# Altium schematic sheet Shematic.SchDoc
size A4
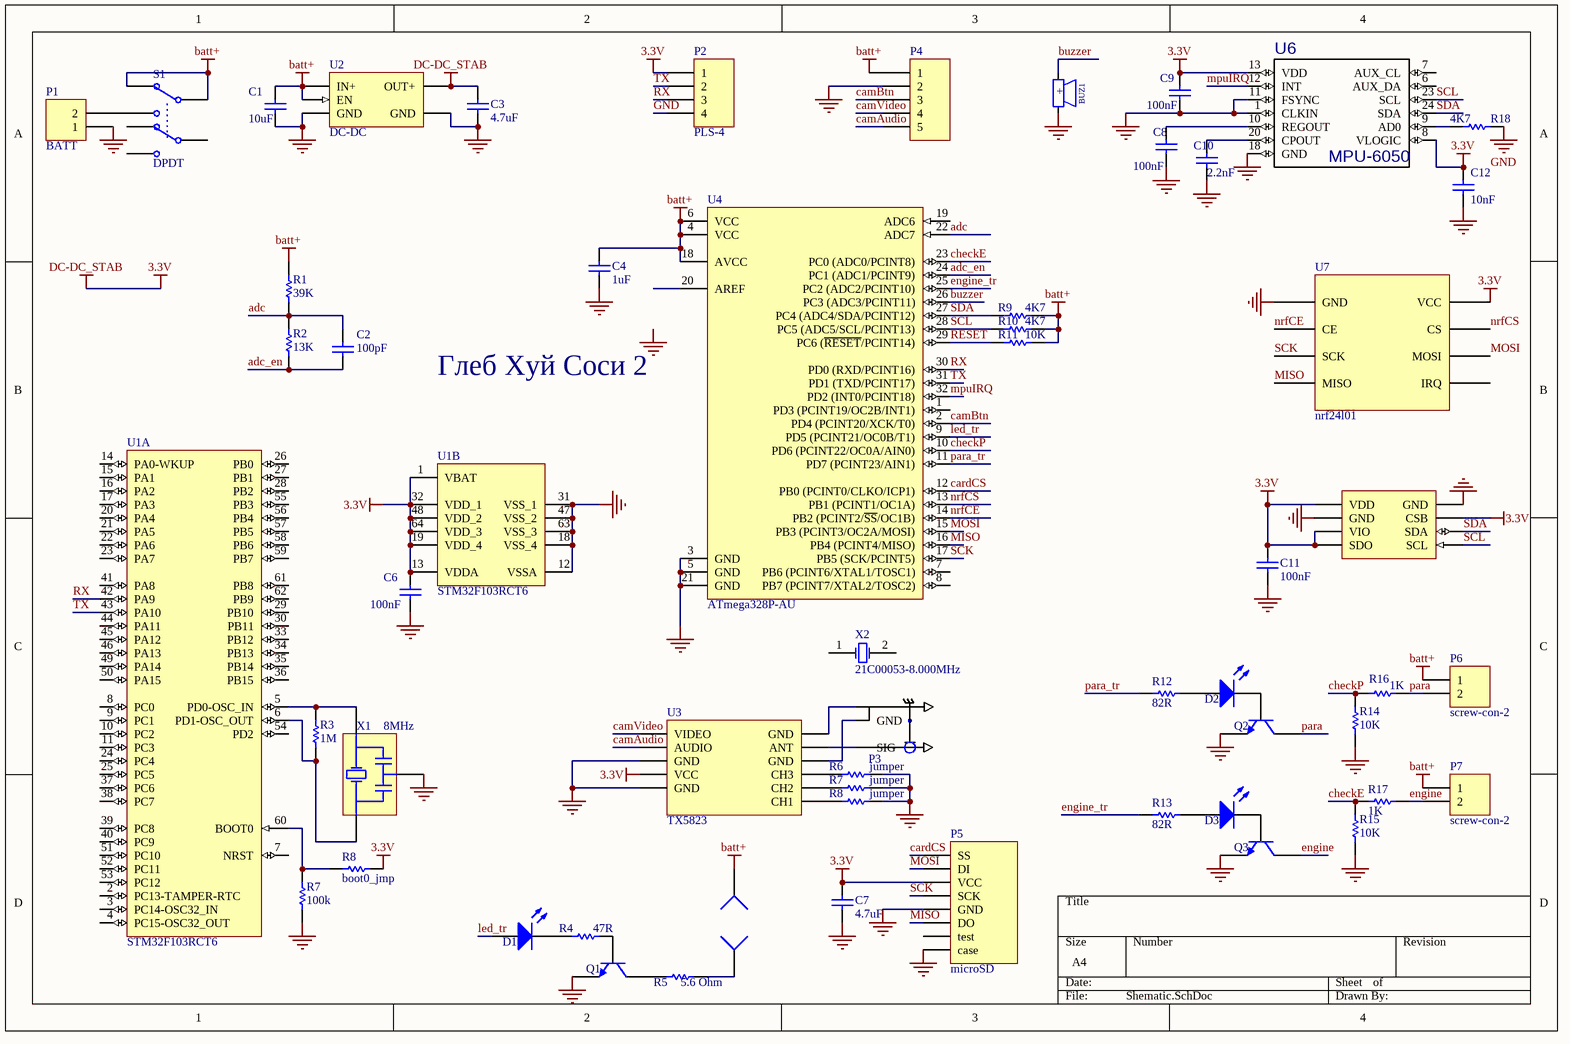
[diagram p0: Shematic.SchDoc]

## Parts
(Parts that share a designator on the sheet are numbered #1, #2 ... from top to bottom, then left to right.)
BUZ1  Buzzer  [BUZ12X7,6MM]  (value not drawn)
C1  10uF  [CAPC1206(3216)190_N]
C2  100pF  [CAPC0805(2012)100_L]
C3  4.7uF  [CAPC0603(1608)100_N]
C4  1uF  [CAPC0603(1608)100_L]
C6  100nF  [CAPC0603(1608)100_N]
C7  4.7uF  [CAPC0603(1608)100_N]
C8  100nF  [CAPC0603(1608)100_N]
C9  100nF  [CAPC0603(1608)100_N]
C10  2.2nF  [CAPC0603(1608)100_L]
C11  100nF  [CAPC0603(1608)100_N]
C12  10nF  [CAPC0603(1608)100_L]
D1  (no value)  [LED0805]
D2  (no value)  [LED0805]
D3  (no value)  [LED0805]
J1  (no value)  [PIN1]
J2  (no value)  [PIN1]
P1  BATT  [XH-2]
P2  PLS-4  [PLS-4]
P3  IPX  [IPX]  (value not drawn)
P4  XH2.54-5  [XH2.54-5]  (value not drawn)
P5  microSD  [microSD holder]
P6  screw-con-2  [screw-con-2]
P7  screw-con-2  [screw-con-2]
Q1  MMBT2222A  [INF-SOT23_M]  (value not drawn)
Q2  MMBT2222A  [INF-SOT23_L]  (value not drawn)
Q3  MMBT2222A  [INF-SOT23_N]  (value not drawn)
R1  39K  [6-0805_L]
R2  13K  [RESC0805(2012)_L]
R3  1M  [RES 0603 (1608) L]
R4  47R  [RESC0805(2012)_N]
R5  5.6 Ohm  [RESC0805(2012)_M]
R6  jumper  [RES 0603 (1608) L]
R7#1  jumper  [RES 0603 (1608) L]
R7#2  100k  [RES 0603 (1608) L]
R8#1  jumper  [RES 0603 (1608) L]
R8#2  boot0_jmp  [RES 0603 (1608) L]
R9  4K7  [RESC0603(1608)_N]
R10  4K7  [RESC0603(1608)_N]
R11  10K  [6-0805_L]
R12  82R  [RESC0805(2012)_L]
R13  82R  [RESC0805(2012)_L]
R14  10K  [RESC0805(2012)_L]
R15  10K  [RESC0805(2012)_L]
R16  1K  [RESC0805(2012)_N]
R17  1K  [RESC1206(3216)_N]
R18  4K7  [RESC0603(1608)_N]
S1  DPDT  [double switch 8.5mm]
U1#1  STM32F103RCT6  [STM-LQFP64_N]  (part A of 2)
U1#2  STM32F103RCT6  [STM-LQFP64_N]  (part B of 2)
U2  DC-DC  [DC-DC step up down S9]
U3  TX5823  [TX5823]
U4  ATmega328P-AU  [32A_M]
U5  BMP280  [LGA-8 BMP280]  (value not drawn)
U6  MPU-6050  [QFN-24-4MM2]
U7  nrf24l01  [NRF24l01 ant]
X1  8MHz  [MURA-CSTCE_G_A-3_V]
X2  21C00053-8.000MHz  [ITTI-21C00053-8.000MHz-2_V]

## Nets
3.3V: C3.2 C6.2 C7.2 C9.1 C11.2 C12.2 P2.1 P5.4(VCC) R8#2.1 U1#2.1(VBAT) U1#2.13(VDDA) U1#2.19(VDD_4) U1#2.32(VDD_1) U1#2.48(VDD_2) U1#2.64(VDD_3) U2.2(OUT+) U3.4(VCC) U5.2(CSB) U5.5(SDO) U5.6(VIO) U5.8(VDD) U6.8(VLOGIC) U6.13(VDD) U7.2(VCC)  [also labelled DC-DC_STAB]
batt+: C1.2 C4.2 J1.1 P4.1 P6.1 P7.1 R1.2 R9.2 R10.2 R11.2 S1.1 S1.2 U2.4(IN+) U2.5(EN) U4.4(VCC) U4.6(VCC) U4.18(AVCC)
GND: BUZ1.1 C1.1 C3.1 C4.1 C6.1 C7.1 C8.1 C9.2 C10.1 C11.1 C12.1 P1.1 P2.4 P4.2 P5.0(case) P5.6(GND) Q1.2(E) Q2.2(E) Q3.2(E) R6.2 R7#1.2 R7#2.1 R8#1.2 R14.1 R15.1 R18.2 U1#2.12(VSSA) U1#2.18(VSS_4) U1#2.31(VSS_1) U1#2.47(VSS_2) U1#2.63(VSS_3) U2.1(GND) U2.3(GND) U3.3(GND) U3.5(GND) U4.3(GND) U4.5(GND) U4.21(GND) U5.1(GND) U5.7(GND) U6.1(CLKIN) U6.11(FSYNC) U6.18(GND) U7.1(GND) X1.2(GND)
adc: C2.2 R1.1 R2.1 U4.22(ADC7)
adc_en: C2.1 R2.2 U4.24(PC1_(ADC1/PCINT9))
buzzer: BUZ1.2 U4.26(PC3_(ADC3/PCINT11))
camAudio: P4.5 U3.2(AUDIO)
camBtn: P4.3 U4.2(PD4_(PCINT20/XCK/T0))
camVideo: P4.4 U3.1(VIDEO)
cardCS: P5.2(SS) U4.12(PB0_(PCINT0/CLKO/ICP1))
checkE: R15.2 R17.1 U4.23(PC0_(ADC0/PCINT8))
checkP: R14.2 R16.1 U4.10(PD6_(PCINT22/OC0A/AIN0))
engine: P7.2 Q3.3(C) R17.2
engine_tr: R13.1 U4.25(PC2_(ADC2/PCINT10))
led_tr: D1.1(A) U4.9(PD5_(PCINT21/OC0B/T1))
MISO: P5.7(DO) U4.16(PB4_(PCINT4/MISO)) U7.7(MISO)
MOSI: P5.3(DI) U4.15(PB3_(PCINT3/OC2A/MOSI)) U7.6(MOSI)
mpuIRQ: U4.32(PD2_(INT0/PCINT18)) U6.12(INT)
nrfCE: U4.14(PB2_(PCINT2/~{SS}/OC1B)) U7.3(CE)
nrfCS: U4.13(PB1_(PCINT1/OC1A)) U7.4(CS)
para: P6.2 Q2.3(C) R16.2
para_tr: R12.1 U4.11(PD7_(PCINT23/AIN1))
RESET: R11.1 U4.29(PC6_(~{RESET}/PCINT14))
RX: P2.3 U1#1.42(PA9) U4.30(PD0_(RXD/PCINT16))
SCK: P5.5(SCK) U4.17(PB5_(SCK/PCINT5)) U7.5(SCK)
SCL: R10.1 U4.28(PC5_(ADC5/SCL/PCINT13)) U5.4(SCL) U6.23(SCL)
SDA: R9.1 U4.27(PC4_(ADC4/SDA/PCINT12)) U5.3(SDA) U6.24(SDA)
TX: P2.2 U1#1.43(PA10) U4.31(PD1_(TXD/PCINT17))
NetC8_2: C8.2 U6.10(REGOUT)
NetC10_2: C10.2 U6.20(CPOUT)
NetD1_2: D1.2(K) R4.1
NetD2_1: D2.1(A) R12.2
NetD2_2: D2.2(K) Q2.1(B)
NetD3_1: D3.1(A) R13.2
NetD3_2: D3.2(K) Q3.1(B)
NetJ2_1: J2.1 R5.2
NetP1_2: P1.2 S1.3
NetP3_1: P3.1(GND) U3.9(GND)
NetP3_2: P3.2(GND) U3.11(GND)
NetP3_3: P3.3(SIG) U3.10(ANT)
NetQ1_1: Q1.1(B) R4.2
NetQ1_3: Q1.3(C) R5.1
NetR3_1: R3.1 U1#1.6(PD1-OSC_OUT) X1.1(X1)
NetR3_2: R3.2 U1#1.5(PD0-OSC_IN) X1.3(X2)
NetR6_1: R6.1 U3.8(CH3)
NetR7#1_1: R7#1.1 U3.7(CH2)
NetR7#2_2: R7#2.2 R8#2.2 U1#1.60(BOOT0)
NetR8#1_1: R8#1.1 U3.6(CH1)
NetR18_1: R18.1 U6.9(AD0)

Not connected (* = marked no-connect by the designer): P5 9(test); S1 4 5 6; U1#1 2(PC13-TAMPER-RTC) 3(PC14-OSC32_IN) 4(PC15-OSC32_OUT) 7(NRST) 8(PC0) 9(PC1) 10(PC2) 11(PC3) 14(PA0-WKUP) 15(PA1) 16(PA2) 17(PA3) 20(PA4) 21(PA5) 22(PA6) 23(PA7) 24(PC4) 25(PC5) 26(PB0) 27(PB1) 28(PB2) 29(PB10) 30(PB11) 33(PB12) 34(PB13) 35(PB14) 36(PB15) 37(PC6) 38(PC7) 39(PC8) 40(PC9) 41(PA8) 44(PA11) 45(PA12) 46(PA13) 49(PA14) 50(PA15) 51(PC10) 52(PC11) 53(PC12) 54(PD2) 55(PB3) 56(PB4) 57(PB5) 58(PB6) 59(PB7) 61(PB8) 62(PB9); U4 1(PD3_(PCINT19/OC2B/INT1)) 7(PB6_(PCINT6/XTAL1/TOSC1)) 8(PB7_(PCINT7/XTAL2/TOSC2)) 19(ADC6) 20(AREF); U6 6(AUX_DA) 7(AUX_CL); U7 8(IRQ); X2 1(X1) 2(X2)

## Notes on the sheet
- Глеб Хуй Соси 2
- Labels drawn without touching a wire or pin: GND
- (in symbol Buzzer) +

## Library data of the parts
BUZ1 = Buzzer: BUZ12X7,6MM; Value: KPX-1203B
C1 = CMP-1037-04983-1: CAP 10uF 50V ±20% 1206 (3216 Metric) Thickness 1.9mm SMD; Tolerance: Â±20%; Case-Metric: 3216; Case-EIA: 1206; Technology: SMT; Max Thickness: 1.9 mm; Rated Voltage: 50 V; Value: 10uF
C2 = CMP-1036-02260-1: CAP 200pF 16V ±10% 0805 (2012 Metric) Thickness 1mm SMD; Case-EIA: 0805; Case-Metric: 2012; Tolerance: Â±10%; Value: 200pF; Technology: SMT; Max Thickness: 1 mm; Rated Voltage: 16 V
C3 C7 = CMP-1035-02789-1: CAP 4.7uF 16V ±20% 0603 (1608 Metric) Thickness 1mm SMD; Case-EIA: 0603; Tolerance: Â±20%; Case-Metric: 1608; Max Thickness: 1 mm; Rated Voltage: 16 V; Technology: SMT; Value: 4.7uF
C4 = CMP-1035-02738-1: CAP 1uF 16V ±20% 0603 (1608 Metric) Thickness 1mm SMD; Case-Metric: 1608; Case-EIA: 0603; Tolerance: Â±20%; Value: 1uF; Rated Voltage: 16 V; Max Thickness: 1 mm; Technology: SMT
C6 C8 C9 C11 = CMP-1035-02585-1: CAP 100nF 16V ±20% 0603 (1608 Metric) Thickness 1mm SMD; Case-EIA: 0603; Tolerance: Â±20%; Case-Metric: 1608; Technology: SMT; Rated Voltage: 16 V; Value: 100nF; Max Thickness: 1 mm
C10 = CMP-1035-02030-1: CAP 2.2nF 16V ±20% 0603 (1608 Metric) Thickness 1mm SMD; Case-Metric: 1608; Case-EIA: 0603; Tolerance: Â±20%; Value: 2.2nF; Technology: SMT; Rated Voltage: 16 V; Max Thickness: 1 mm
C12 = CMP-1035-02312-1: CAP 10nF 16V ±20% 0603 (1608 Metric) Thickness 1mm SMD; Case-EIA: 0603; Tolerance: Â±20%; Case-Metric: 1608; Max Thickness: 1 mm; Value: 10nF; Technology: SMT; Rated Voltage: 16 V
D1-D3 = LED0: Typical INFRARED GaAs LED; Published: 8-Jun-2000; LatestRevisionDate: 08-Jul-2005; LatestRevisionNote: Mech Layer 1 removed.; PackageReference: LED-0; Publisher: Altium Limited; PackageDescription: LED; 2 Leads
J1 J2 = Socket: LatestRevisionDate: 17-Jul-2002; LatestRevisionNote: Re-released for DXP Platform.; Publisher: Altium Limited
P1 = XH-2: XH 2-pin, 2.4mm pitch; LatestRevisionDate: 17-Jul-2002; LatestRevisionNote: Re-released for DXP Platform.; Publisher: Altium Limited
P2 = PLS-4: Single row pins
P5 = microSD: microSD holder; LatestRevisionDate: 17-Jul-2002; LatestRevisionNote: Re-released for DXP Platform.; Publisher: Altium Limited
P6 P7 = screw-con-2: screw con 2-pin, 5.08mm pitch; LatestRevisionDate: 17-Jul-2002; LatestRevisionNote: Re-released for DXP Platform.; Publisher: Altium Limited
Q1-Q3 = CMP-1178-00009-1: NPN Silicon Switching Transistor, 40 V VCEO, 600 mA IC, SOT23, Reel, Green; Manufacturer: Infineon; VCBO (max): 75 V; IC: 150 mA; ICBO (max): 10 nA; VCE (max): 10 V; VCEO (max): 40 V; VEBO (max): 6 V; IC (max): 600 mA; Green: TRUE; ComponentLink1URL: http://www.infineon.com/; ComponentLink2Description: Datasheet; Mounting Technology: Surface Mount; ComponentLink3URL: http://www.infineon.com/dgdl/SOT23-Package_Overview.pdf?folderId=db3a30431936bc4b0119532290053c66&fileId=db3a30431936bc4b0119533468123c85; PackageDescription: 3-Pin Small Outline Transistor Package, 1.3 x 2.9 mm Body, 0.95 mm Pitch; Packing: Reel; PackageVersion: Apr-08; PartNumber: MMBT2222A; Polarity: NPN; ComponentLink2URL: http://www.infineon.com/dgdl/smbt2222a_mmbt2222a.pdf?folderId=db3a30431441fb5d011445fab851018e&fileId=db3a30431441fb5d011445fbaff0018f; PackageReference: SOT23; VCE: 10 V; ComponentLink1Description: Manufacturer URL; ComponentLink3Description: Package Specification
R1 = CMP-1014-00112-1: 39K 0.25W 5% 1206 (3216 Metric)  SMD; Value: 39000.00 Ohm; Case-Metric: 3216; Case-EIA: 1206; Tolerance: 5 %; Power: 0.25 W; Technology: SMT
R2 = CMP-1013-00101-1: 13K 0.125W 5% 0805 (2012 Metric)  SMD; Case-Metric: 2012; Case-EIA: 0805; Value: 13000.00 Ohm; Power: 0.125 W; Tolerance: 5 %; Technology: SMT
R3 R6 R7#1 R7#2 R8#1 R8#2 = Res 0603: Case-EIA: 0603; Case-Metric: 1608; Power: 0.1W; Technology: SMT
  R3: Value: 1M
  R6 R7#1 R8#1: Value: jumper
  R7#2: Value: 100k
  R8#2: Value: boot0_jmp
R4 = CMP-1013-00060-1: 270R 0.125W 5% 0805 (2012 Metric)  SMD; Case-Metric: 2012; Case-EIA: 0805; Value: 47R; Power: 0.125 W; Technology: SMT; Tolerance: 5 %
R5 = CMP-1013-00050-1: 100R 0.125W 5% 0805 (2012 Metric)  SMD; Case-EIA: 0805; Case-Metric: 2012; Tolerance: 5 %; Power: 0.125 W; Technology: SMT; Value: 5.6 Ohm
R9 R10 R18 = CMP-1012-00090-1: 4K7 0.1W 5% 0603 (1608 Metric)  SMD; Case-Metric: 1608; Value: 4700.00 Ohm; Case-EIA: 0603; Tolerance: 5 %; Technology: SMT; Power: 0.1 W
R11 = CMP-1014-00098-1: Power: 0.25 W; Tolerance: 5 %; Value: 10000.00 Ohm; Case-Metric: 3216; Case-EIA: 1206; Technology: SMT
R12 R13 = CMP-1013-00011-1: 2R4 0.125W 5% 0805 (2012 Metric)  SMD; Case-EIA: 0805; Case-Metric: 2012; Technology: SMT; Power: 0.125 W; Value: 82R; Tolerance: 5 %
R14 R15 = CMP-1013-00098-1: 10K 0.125W 5% 0805 (2012 Metric)  SMD; Case-EIA: 0805; Case-Metric: 2012; Value: 10000.00 Ohm; Power: 0.125 W; Technology: SMT; Tolerance: 5 %
R16 = CMP-1013-00074-1: 1K 0.125W 5% 0805 (2012 Metric)  SMD; Case-EIA: 0805; Case-Metric: 2012; Value: 1000.00 Ohm; Technology: SMT; Power: 0.125 W; Tolerance: 5 %
R17 = CMP-1014-00074-1: 1K 0.25W 5% 1206 (3216 Metric)  SMD; Value: 1000.00 Ohm; Case-Metric: 3216; Case-EIA: 1206; Tolerance: 5 %; Power: 0.25 W; Technology: SMT
S1 = Double switch: Different footprints; Published: 24-Mar-1999; LatestRevisionDate: 17-Jul-2002; LatestRevisionNote: Re-released for DXP Platform.; PackageReference: DPDT-6; Publisher: Altium Limited; PackageDescription: Switch; 6 Leads
U1#1 U1#2 = CMP-0237-00009-4: ARM Cortex-M3 32-bit MCU, 256 KB Flash, 48 KB Internal RAM, 51 I/Os, 64-pin LQFP, -40 to 85 degC, Tray; I/Os (High Current): 51; Supply Voltage(Vcc) min (V): 2; Operating Frequency(F) (Processor speed) (MHz): 72; D/A Converter: 2x12-bit (2 Channel); Internal RAM Size (kB): 48; FLASH Size (Prog) (kB): 256; A/D Converter: 3x12-bit (16 Channel); Mounting Technology: Surface Mount; ComponentLink2URL: http://www.st.com/st-web-ui/static/active/en/resource/technical/document/datasheet/CD00191185.pdf; ComponentLink1Description: Manufacturer URL; ComponentLink1URL: http://www.st.com/web/en/home.html; Packing: Tray; ComponentLink3URL: http://www.st.com/st-web-ui/static/active/en/resource/technical/document/datasheet/DM00037051.pdf; ComponentLink2Description: Datasheet; Core: ARM Cortex-M3; DatasheetVersion: Rev. 8; PackageReference: LQFP64; ComponentLink3Description: Package Specification; PackageVersion: Rev. 4, 06/2013; PackageDescription: 64-Pin Low Profile Quad Flat Package, 10 x 10 mm Body, 0.5 mm Pitch; PartNumber: STM32F103RCT6
U2 = DC-DC step up down S9
U3 = TX5823: FPV video transmitter 200mW
U4 = CMP-0095-00269-2: 8-bit AVR Microcontroller, 32KB Flash, 1KB EEPROM, 2KB SRAM, 32-pin TQFP, Industrial Grade (-40°C to 85°C); PackageDescription: 32-Lead, 7x7x1.0 mm Body, 0.8mm Lead Pitch, Thin Profile Plastic Quad Flat Package (TQFP); DatasheetVersion: revD, May-2011; RevisionNote: DatasheetVersion & PackageVersion updated. URLs added.; ComponentLink1URL: http://www.atmel.com/; ComponentLink2Description: ATmega48A/48PA/88A/88PA/168A/168PA/328/328P Datasheet; Code_JEDEC: MS-026-ABA; ComponentLink1Description: Manufacturer URL; PackageReference: 32A; ComponentLink3Description: ATmega48A/48PA/88A/88PA/168A/168PA/328/328P Summary; ComponentLink2URL: http://www.atmel.com/dyn/resources/prod_documents/doc8271.pdf; PackageVersion: revC, Oct-2010; ComponentLink3URL: http://www.atmel.com/dyn/resources/prod_documents/8271S.pdf
U7 = NRF24L01: Wirless module 2.4GHz
X1 = CMP-2100-03620-1: Ceramic Resonator, 8 MHz, +/- 0.5%, -20 to 80 degC, 3-Pin SMD, RoHS, Tape and Reel; Manufacturer: Murata; Capacitance: 33pF; Frequency Stability: 0.2%; Datasheet Version: 42339.0; RoHSCompliant: True; Datasheet URL: http://www.murata.com/~/media/webrenewal/support/library/catalog/products/timingdevice/ceralock/p16e.ashx; Case/Package: Ceramic; Load Capacitance: 33pF; Tolerance: 0.5%; Self Resonant Frequency: 8MHz; Mount: SurfaceMount; Height: 0.031inch; Number of Pins: 3; Package Description: 3-Pin Surface Mount Device, Body 3.2 x 1.3 mm, Pitch 1.2 mm; Package Quantity: 1; Lead Free: LeadFree; Contact Plating: Gold; REACH SVHC: NoSVHC; Length: 0.126inch; Width: 0.051inch; Manufacturer URL: http://www.murata.com/; Packaging: TapeandReel; Termination: SMD/SMT; Frequency Tolerance: 0.5%; Max Operating Temperature: 80degC; Composition: Ceramic; Package Reference: CSTCE_G_A-3; Min Operating Temperature: -20degC; Frequency: 8MHz
X2 = CMP-0464-00002-2: Crystal,  8 MHz, -40 to 85 degC, 5 x 3.2 x 1.23 mm SMD; Manufacturer: ITTI; Nominal Frequency: 8 MHz; Frequency Tolerance: +/-20 ppm; Overtone order: Fundamental; Load Capacitance: 10 pF; PartNumber: 21C00053-8.000MHz; Operating temperature: -40 to 85 degC; ComponentLink1URL: http://www.itti-co.com; ComponentLink1Description: Manufacturer URL; PackageReference: 21C00053-8.000MHz-2; Mounting Technology: Surface Mount; PackageDescription: 2-Pin Hand Drawn, Body 5x3.2mm, Pitch 3.8mm
U5 = BMP280: Value: *
U6 = MPU-6050: Value: *